# Altium schematic sheet Bluetooth.SchDoc
size A4
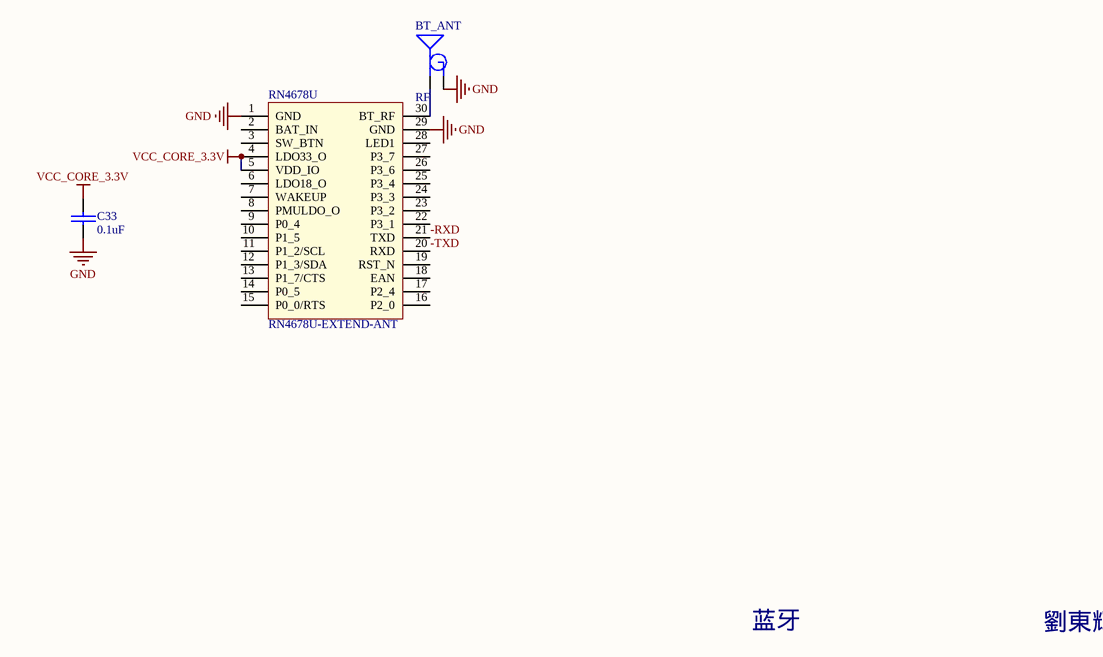
[diagram p0: Bluetooth.SchDoc]

## Parts
BT_ANT  RF  [HIROSE_U.FL-R-SMT-1(10)]
C33  0.1uF  [0805/2012 C3]
RN4678U  RN4678U-EXTEND-ANT  [RN4678U-EXTEND-ANT]

## Nets
GND: BT_ANT.2 C33.2 RN4678U.1(GND) RN4678U.29(GND)
VCC_CORE_3.3V: C33.1 RN4678U.4(LDO33_O) RN4678U.5(VDD_IO)
-RXD: RN4678U.21(TXD)
-TXD: RN4678U.20(RXD)
NetBT_ANT_1: BT_ANT.1 RN4678U.30(BT_RF)

Not connected (* = marked no-connect by the designer): RN4678U 2(BAT_IN) 3(SW_BTN) 6(LDO18_O) 7(WAKEUP) 8(PMULDO_O) 9(P0_4) 10(P1_5) 11(P1_2/SCL) 12(P1_3/SDA) 13(P1_7/CTS) 14(P0_5) 15(P0_0/RTS) 16(P2_0) 17(P2_4) 18(EAN) 19(RST_N) 22(P3_1) 23(P3_2) 24(P3_3) 25(P3_4) 26(P3_6) 27(P3_7) 28(LED1)

## Notes on the sheet
- 蓝牙
- 劉東輝

## Library data of the parts
C33 = Pro39.tmp_22P_32